# Altium schematic sheet A-Headers.SchDoc: TE0890 - S7Mini
size A4; Organization: Trenz Electronic GmbH; DocumentNumber: TE0890; Revision: 01; SheetNumber: 2; SheetTotal: 6; Date: 2018-08-06; Author: Vitali Tsiukala; CompanyName: Trenz Electronic GmbH; DrawnBy: Vitali Tsiukala; Engineer: Vitali Tsiukala; ProjectName: TE0723 Arduino
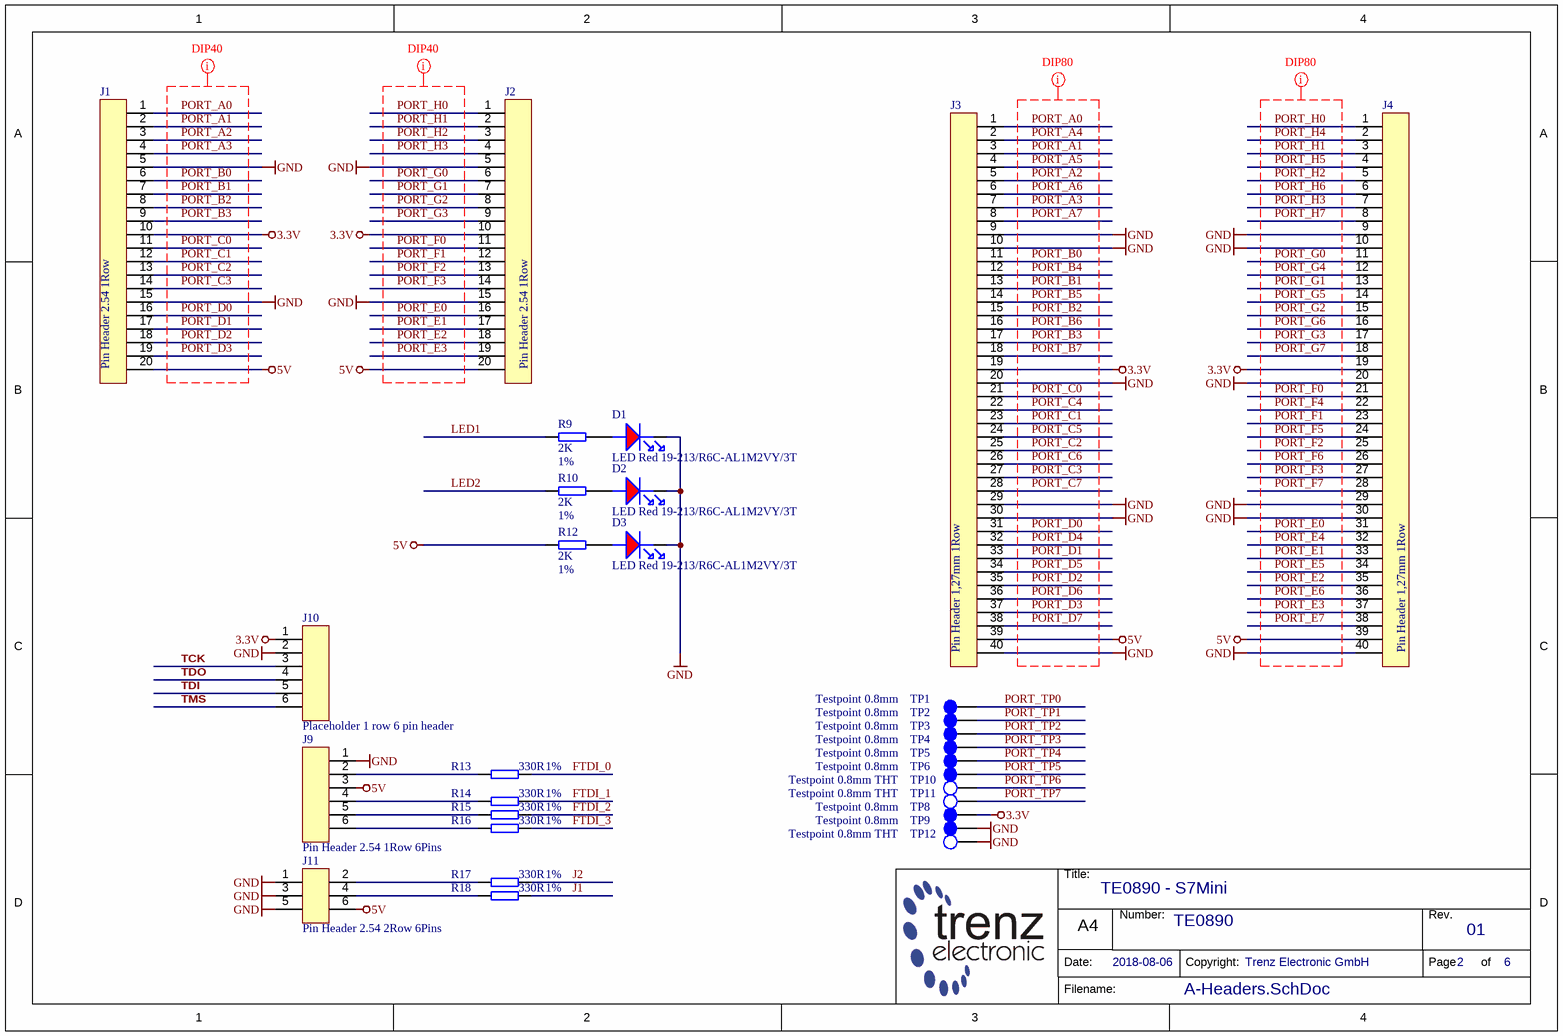
[diagram p0: A-Headers.SchDoc]

## Parts
D1  LED Red 19-213/R6C-AL1M2VY/3T  [LEDC1608X55N_RED]
D2  LED Red 19-213/R6C-AL1M2VY/3T  [LEDC1608X55N_RED]
D3  LED Red 19-213/R6C-AL1M2VY/3T  [LEDC1608X55N_RED]
J1  Pin Header 2.54 1Row  [STIFTLEISTE2_54 OG 1R-20]
J2  Pin Header 2.54 1Row  [STIFTLEISTE2_54 OG 1R-20]
J3  Pin Header 1,27mm 1Row  [STIFTLEISTE1_27 OG 1R-40]
J4  Pin Header 1,27mm 1Row  [STIFTLEISTE1_27 OG 1R-40]
J9  Pin Header 2.54 1Row 6Pins  [STIFTLEISTE2_54 OG 1R-6]
J10  Placeholder 1 row 6 pin header  [STIFTLEISTE2_54 OG 1R-6V]
J11  Pin Header 2.54 2Row 6Pins  [STIFTLEISTE2_54 OG 2R-6]
R9  2K  Tolerance: 1%  [RESC1005X40N]
R10  2K  Tolerance: 1%  [RESC1005X40N]
R12  2K  Tolerance: 1%  [RESC1005X40N]
R13  330R  Tolerance: 1%  [RESC1005X40N]
R14  330R  Tolerance: 1%  [RESC1005X40N]
R15  330R  Tolerance: 1%  [RESC1005X40N]
R16  330R  Tolerance: 1%  [RESC1005X40N]
R17  330R  Tolerance: 1%  [RESC1005X40N]
R18  330R  Tolerance: 1%  [RESC1005X40N]
TP1  Testpoint 0.8mm  [TP_0.8mm]
TP2  Testpoint 0.8mm  [TP_0.8mm]
TP3  Testpoint 0.8mm  [TP_0.8mm]
TP4  Testpoint 0.8mm  [TP_0.8mm]
TP5  Testpoint 0.8mm  [TP_0.8mm]
TP6  Testpoint 0.8mm  [TP_0.8mm]
TP8  Testpoint 0.8mm  [TP_0.8mm]
TP9  Testpoint 0.8mm  [TP_0.8mm]
TP10  Testpoint 0.8mm THT  [TP_0.8mm_THT]
TP11  Testpoint 0.8mm THT  [TP_0.8mm_THT]
TP12  Testpoint 0.8mm THT  [TP_0.8mm_THT]

## Nets
3.3V: J1.10 J2.10 J3.19 J4.19 J10.1 TP8.1
5V: J1.20 J2.20 J3.39 J4.39 J9.3 J11.6 R12.1
GND: D1.K D2.K D3.K J1.5 J1.15 J2.5 J2.15 J3.9 J3.10 J3.20 J3.29 J3.30 J3.40 J4.9 J4.10 J4.20 J4.29 J4.30 J4.40 J9.1 J10.2 J11.1 J11.3 J11.5 TP9.1 TP12.1
FTDI_0: R13.2
FTDI_1: R14.2
FTDI_2: R15.2
FTDI_3: R16.2
J1: R18.2
J2: R17.2
LED1: R9.1
LED2: R10.1
PORT_A0: J1.1 J3.1
PORT_A1: J1.2 J3.3
PORT_A2: J1.3 J3.5
PORT_A3: J1.4 J3.7
PORT_A4: J3.2
PORT_A5: J3.4
PORT_A6: J3.6
PORT_A7: J3.8
PORT_B0: J1.6 J3.11
PORT_B1: J1.7 J3.13
PORT_B2: J1.8 J3.15
PORT_B3: J1.9 J3.17
PORT_B4: J3.12
PORT_B5: J3.14
PORT_B6: J3.16
PORT_B7: J3.18
PORT_C0: J1.11 J3.21
PORT_C1: J1.12 J3.23
PORT_C2: J1.13 J3.25
PORT_C3: J1.14 J3.27
PORT_C4: J3.22
PORT_C5: J3.24
PORT_C6: J3.26
PORT_C7: J3.28
PORT_D0: J1.16 J3.31
PORT_D1: J1.17 J3.33
PORT_D2: J1.18 J3.35
PORT_D3: J1.19 J3.37
PORT_D4: J3.32
PORT_D5: J3.34
PORT_D6: J3.36
PORT_D7: J3.38
PORT_E0: J2.16 J4.31
PORT_E1: J2.17 J4.33
PORT_E2: J2.18 J4.35
PORT_E3: J2.19 J4.37
PORT_E4: J4.32
PORT_E5: J4.34
PORT_E6: J4.36
PORT_E7: J4.38
PORT_F0: J2.11 J4.21
PORT_F1: J2.12 J4.23
PORT_F2: J2.13 J4.25
PORT_F3: J2.14 J4.27
PORT_F4: J4.22
PORT_F5: J4.24
PORT_F6: J4.26
PORT_F7: J4.28
PORT_G0: J2.6 J4.11
PORT_G1: J2.7 J4.13
PORT_G2: J2.8 J4.15
PORT_G3: J2.9 J4.17
PORT_G4: J4.12
PORT_G5: J4.14
PORT_G6: J4.16
PORT_G7: J4.18
PORT_H0: J2.1 J4.1
PORT_H1: J2.2 J4.3
PORT_H2: J2.3 J4.5
PORT_H3: J2.4 J4.7
PORT_H4: J4.2
PORT_H5: J4.4
PORT_H6: J4.6
PORT_H7: J4.8
PORT_TP0: TP1.1
PORT_TP1: TP2.1
PORT_TP2: TP3.1
PORT_TP3: TP4.1
PORT_TP4: TP5.1
PORT_TP5: TP6.1
PORT_TP6: TP10.1
PORT_TP7: TP11.1
TCK: J10.3
TDI: J10.5
TDO: J10.4
TMS: J10.6
NetD1_A: D1.A R9.2
NetD2_A: D2.A R10.2
NetD3_A: D3.A R12.2
NetJ9_2: J9.2 R13.1
NetJ9_4: J9.4 R14.1
NetJ9_5: J9.5 R15.1
NetJ9_6: J9.6 R16.1
NetJ11_2: J11.2 R17.1
NetJ11_4: J11.4 R18.1

## Layout directives
net class DIP40: PORT_A0, PORT_A1, PORT_A2, PORT_A3, PORT_B0, PORT_B1, PORT_B2, PORT_B3, PORT_C0, PORT_C1, PORT_C2, PORT_C3, PORT_D0, PORT_D1, PORT_D2, PORT_D3, PORT_E0, PORT_E1, PORT_E2, PORT_E3, PORT_F0, PORT_F1, PORT_F2, PORT_F3, PORT_G0, PORT_G1, PORT_G2, PORT_G3, PORT_H0, PORT_H1, PORT_H2, PORT_H3
net class DIP80: PORT_A0, PORT_A1, PORT_A2, PORT_A3, PORT_A4, PORT_A5, PORT_A6, PORT_A7, PORT_B0, PORT_B1, PORT_B2, PORT_B3, PORT_B4, PORT_B5, PORT_B6, PORT_B7, PORT_C0, PORT_C1, PORT_C2, PORT_C3, PORT_C4, PORT_C5, PORT_C6, PORT_C7, PORT_D0, PORT_D1, PORT_D2, PORT_D3, PORT_D4, PORT_D5, PORT_D6, PORT_D7, PORT_E0, PORT_E1, PORT_E2, PORT_E3, PORT_E4, PORT_E5, PORT_E6, PORT_E7, PORT_F0, PORT_F1, PORT_F2, PORT_F3, PORT_F4, PORT_F5, PORT_F6, PORT_F7, PORT_G0, PORT_G1, PORT_G2, PORT_G3, PORT_G4, PORT_G5, PORT_G6, PORT_G7, PORT_H0, PORT_H1, PORT_H2, PORT_H3, PORT_H4, PORT_H5, PORT_H6, PORT_H7

## Notes on the sheet
- Title:
- Number:
- Rev.
- Date:
- A4
- Copyright:
- Page
- of
- Filename:

## Library data of the parts
D1-D3 = 28261: Chip LED 0603 Briliant Red; AN: 28261; Mixed: SMT; Case: 1608 (0603); HelpURL: b:\AD\adlib\datasheet\19-213-R6C\; H-ART: 19-213/R6C-AL1M2VY/3T
J1 J2 = 29193: Stiftleiste versetzt 1-reihig, 20pol.; AN: 29193; Mixed: THT; H-ART: 943-12-020-00; Temperature-Range: -40/+125; HelpURL: b:\AD\adlib\datasheet\W+P_943_944_945\
J3 J4 = 29194: Stiftleiste versetzt 1-reihig, 40pol.; AN: 29194; Mixed: THT; Temperature-Range: -40/+125; H-ART: 702-40-40-00; HelpURL: b:\AD\adlib\datasheet\W+P_702_703\
J9 = 28042: Stiftleiste gerade 1-reihig, 6pol; AN: 28042; Mixed: THT
J10 = 22911: Stiftleiste versetzt 1-reihig, 6pol.; AN: 22911; Mixed: THT; Trenz-Stock: Yes
J11 = 22334: Stiftleiste gerade 2-reihig, 6pol.; AN: 22334; Mixed: THT; Trenz-Stock: Yes
R9 R10 R12 = 25073: WID SMD 2K 1% 0,063W; AN: 25073; Mixed: SMT; H-ART: RC0402FR-072KL; Case: 1005 (0402); Technology: TK100; Value: 2K
R13-R18 = 22762: WID SMD 330R 1% 0,063W  BF 1005 (0402); AN: 22762; Mixed: SMT; Value: 330; Preferred: Yes; H-ART: RC0402FR-13330RL; Case: 1005 (0402); Technology: TK100
TP1-TP6 TP8 TP9 = 26289: AN: 26289; Mixed: MECH
TP10-TP12 = 27481: Testpoint 0.8mm TH; AN: 27481